# EAGLE board half (EAGLE 8.2.2)
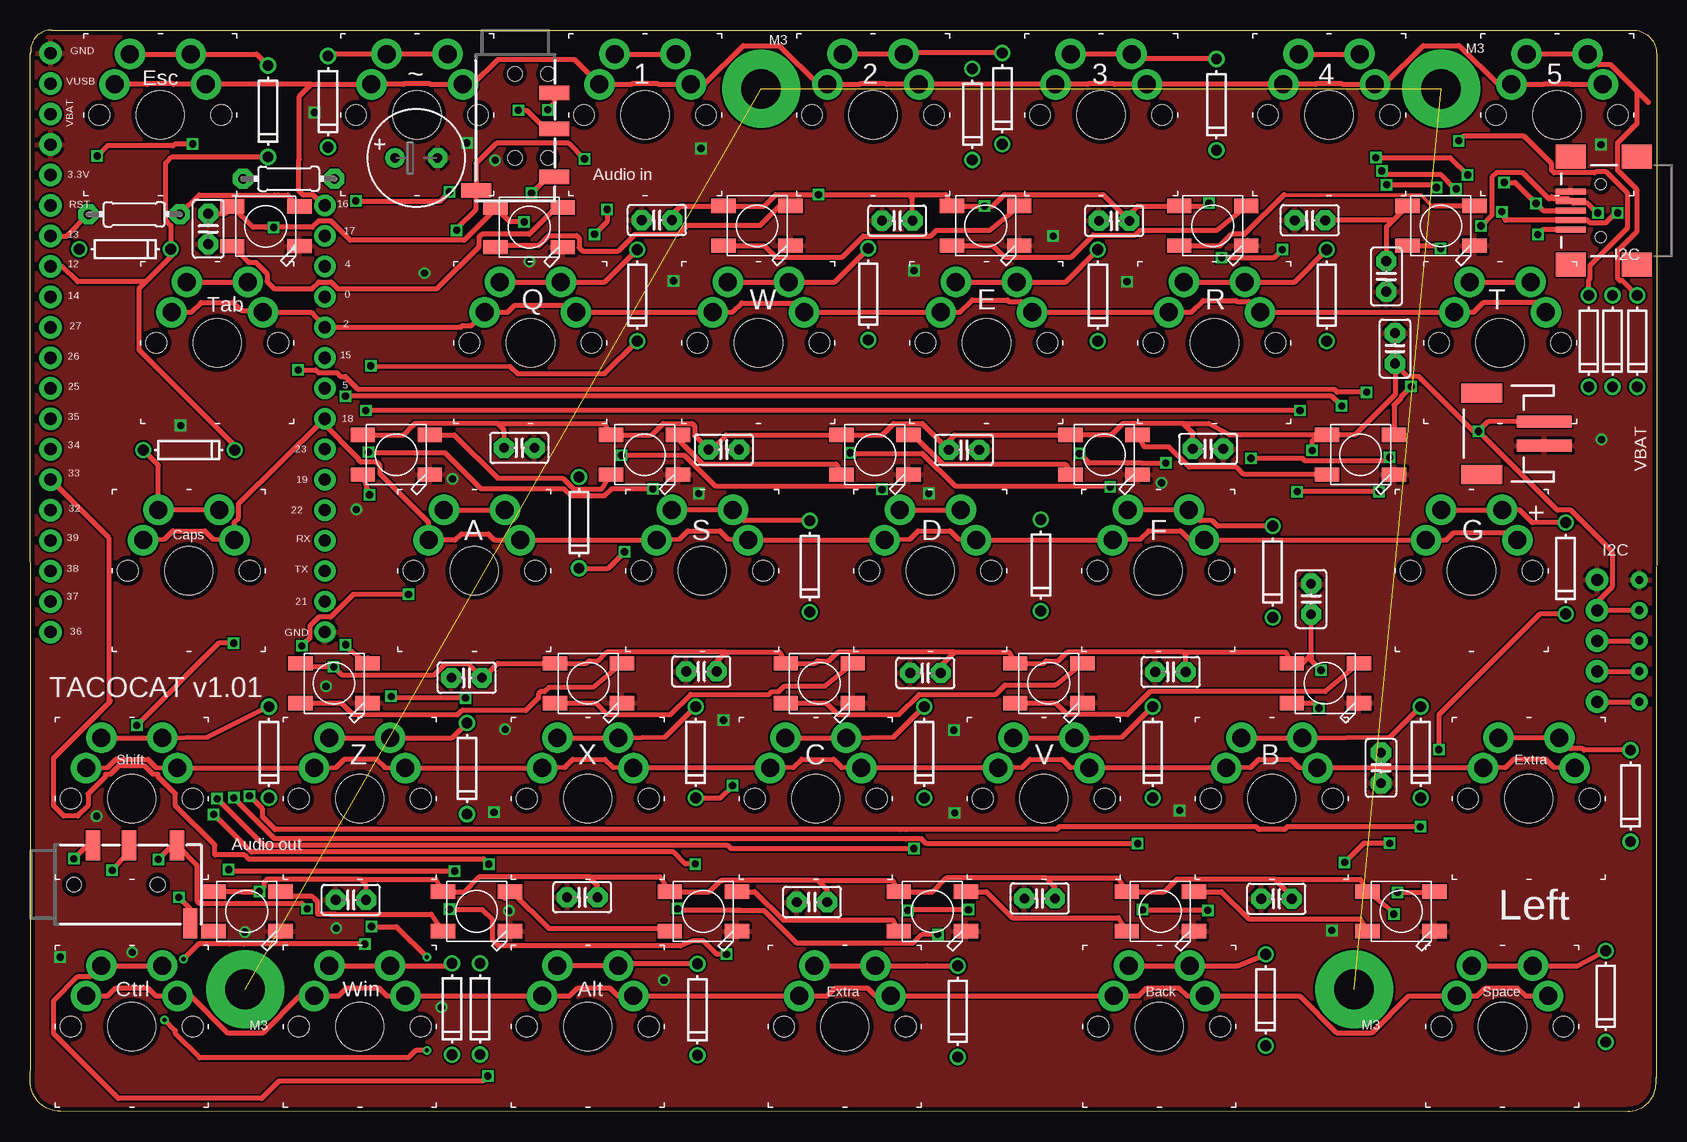
[diagram p3: board, top side]
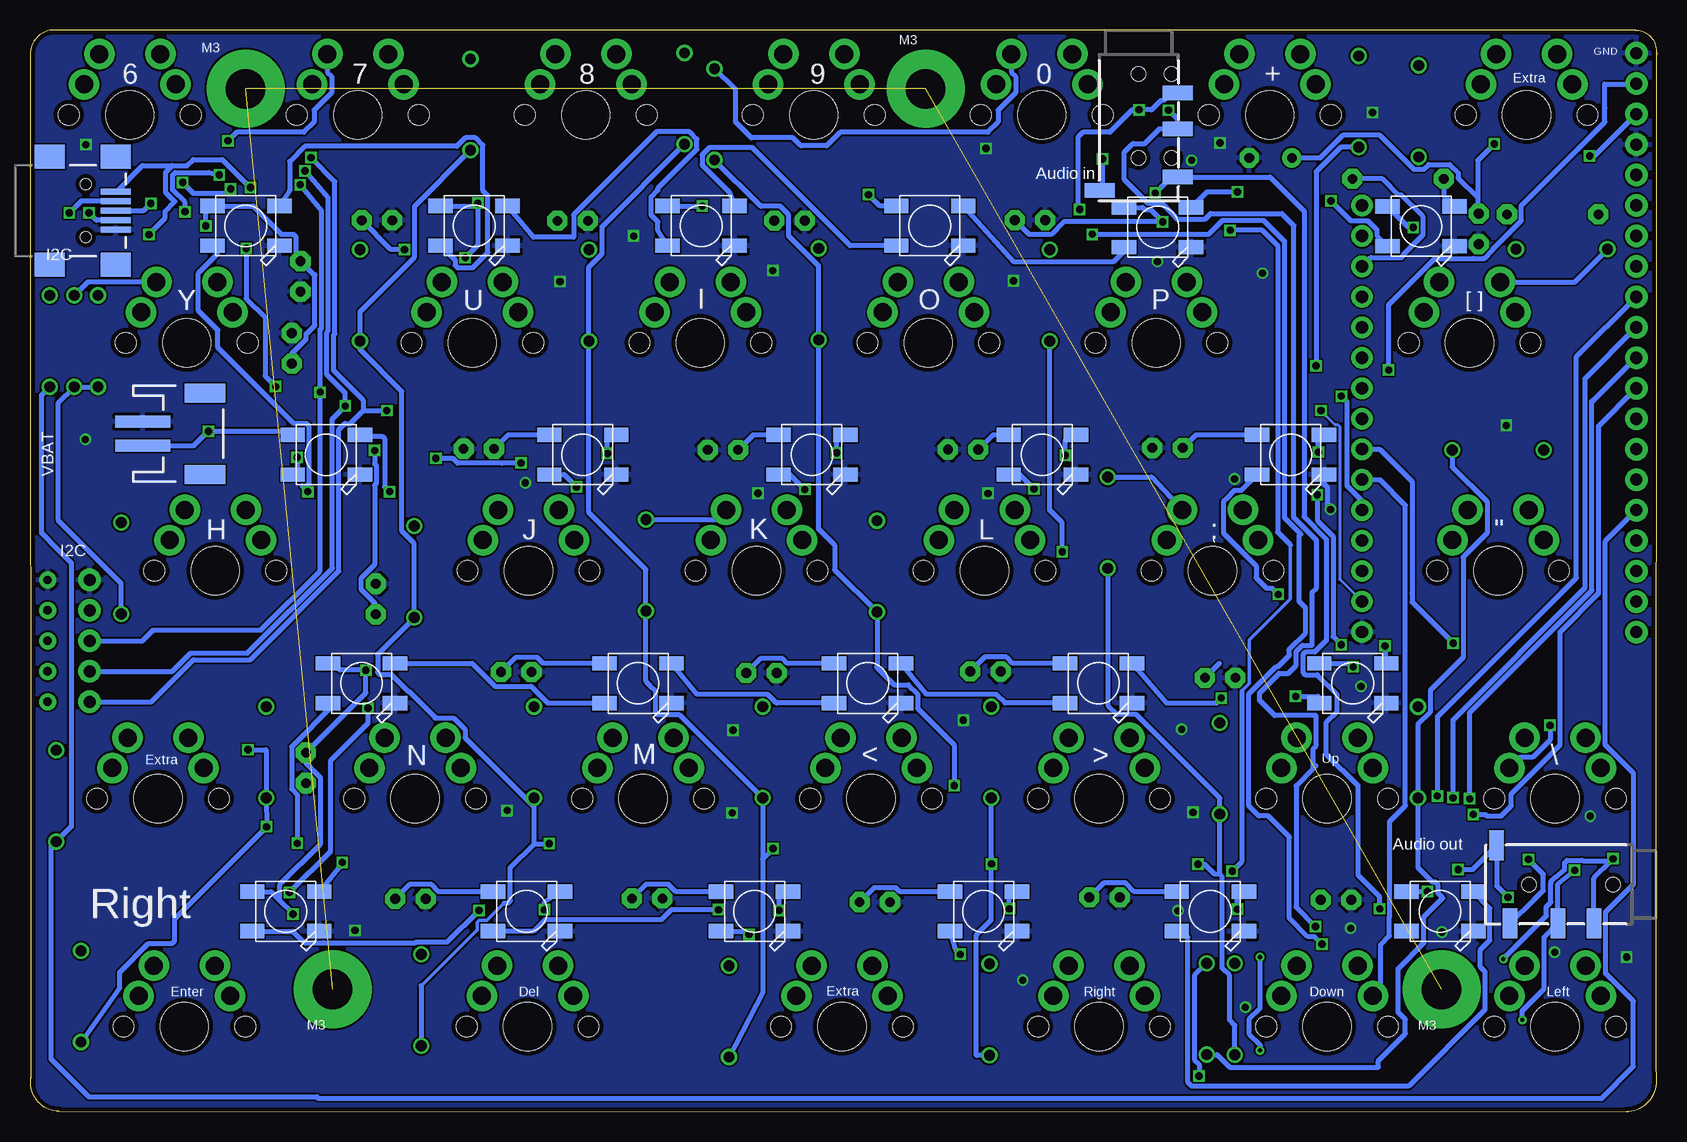
[diagram p4: board, bottom side, seen from below]

Size 135.57 x 90.17 mm. Coordinates in mm from the lower left corner, seen from the top.
Outline: 135.57,88.21 135.52,2.79
Outline: 133.21,0.03 2.46,0
Outline: 0.05,3.34 0,88.22
Outline: 1.75,90.17 1.8,90.17
Outline: 1.8,90.17 133.55,90.17
Outline: 133.55,90.17 133.56,90.17
Outline: 0,88.32 0,88.22
Outline: 0,88.22 0,88.12
Outline: 2.55,0.02 arc-90 0,2.57 0,3.32
Outline: 133.15,0.02 arc90 135.5,2.37 135.5,2.82
Outline: 1.8,90.17 arc90 0.05,88.42 0.05,88.27
Outline: 133.55,90.17 arc-90 135.55,88.17 135.55,88.12
Copper layers (1*16): Top 0.0356mm / dielectric 1.5011mm / Bottom 0.0356mm
Design rules "OshPark *": minimum track width 6mil, minimum drill 13mil, track to track 6mil, track to pad 6mil, pad to pad 6mil, via to via 6mil, smd to smd 6mil, copper to edge 15mil, drill to drill 6mil, minimum pad ring 7mil, minimum via ring 7mil, stop-mask expansion 1mil, vias tented up to drill 0mil, thermal gap 10mil

## Footprints (pad centres in the part's own frame; a part is rotated, then mirrored left to right if it is on the bottom)
C025-025X050 = drill 0.813 pad 1.676 octagon: 1 -1.27,0; 2 1.27,0
E3,5-8 = drill 0.813 pad 1.6: + -1.778,0 | drill 0.813 pad 1.6 octagon: - 1.778,0
DO-1N4148 = drill 0.9: A -3.81,0; C 3.81,0
1X20_NOSILK = drill 1.016 pad 1.88: 1 0,0; 2 2.54,0; 3 5.08,0; 4 7.62,0; 5 10.16,0; 6 12.7,0; 7 15.24,0; 8 17.78,0; 9 20.32,0; 10 22.86,0; 11 25.4,0; 12 27.94,0; 13 30.48,0; 14 33.02,0; 15 35.56,0; 16 38.1,0; 17 40.64,0; 18 43.18,0; 19 45.72,0; 20 48.26,0
1X05_NO_SILK_SMALL = drill 0.7 pad 1.422: 1 0,0; 2 2.54,0; 3 5.08,0; 4 7.62,0; 5 10.16,0
USB-MINIB = smd 2.5 x 0.5: D+ 2.5,0; D- 2.5,0.8; GND 2.5,-1.6; ID 2.5,-0.8; VBUS 2.5,1.6 | smd 2.5 x 2: S1 -3,4.5; S2 2.5,4.5; S3 -3,-4.5; S4 2.5,-4.5 | hole 0.9: 0,2.2; 0,-2.2
JST-2-SMD = smd 1 x 4.6: 1 -1,-3.7; 2 1,-3.7 | smd 1.6 x 3.4: NC1 -3.4,1.5; NC2 3.4,1.5
AUDIO_JACK_3.5MM_TRRS_SMD_RA = smd 1.2 x 2.5: EARTH 11.3,-3.25; RING1 6.2,3.25; RING2 3.2,3.25; TIP 10.2,3.25 | hole 1.2: 1.6,0; 8.6,0
1X05_NO_SILK = drill 1.016 pad 1.88: 1 0,0; 2 2.54,0; 3 5.08,0; 4 7.62,0; 5 10.16,0
1X15-CB = drill 1.016 pad 1.778: 1 -17.78,0; 2 -15.24,0; 3 -12.7,0; 4 -10.16,0; 5 -7.62,0; 6 -5.08,0; 7 -2.54,0; 8 0,0; 9 2.54,0; 10 5.08,0; 11 7.62,0; 12 10.16,0; 13 12.7,0; 14 15.24,0; 15 17.78,0
WS2812B-NARROW-PADS = smd 2.032 x 1.2: 1-VDD 2.794,-1.65; 2-DOUT 2.794,1.65; 3-GND -2.794,1.65; 4-DIN -2.794,-1.65
0204/7 = drill 0.813 pad 1.676 octagon: 1 -3.81,0; 2 3.81,0
CHERRY-MX-SYMM-NOSILK = drill 1.5 pad 2.54: SW1@0 -3.81,2.54; SW1@1 3.81,2.54; SW2@0 2.54,5.08; SW2@1 -2.54,5.08 | hole 4: 0,0 | hole 1.714: 5.08,0; -5.08,0

## Placement (x,y rotation side)
C1  .1 uF  [C025-025X050]  98.17,55.25 0 top
C2  .1 uF  [C025-025X050]  40.77,55.33 0 top
C3  .1 uF  [C025-025X050]  90.35,74.26 180 top
C4  .1 uF  [C025-025X050]  113.75,63.62 90 top
C5  .1 uF  [C025-025X050]  72.27,74.27 180 top
C6  .1 uF  [C025-025X050]  113.03,69.62 270 top
C7  .1 uF  [C025-025X050]  77.83,55.16 0 top
C8  .1 uF  [C025-025X050]  106.66,74.3 180 top
C9  .1 uF  [C025-025X050]  57.81,55.19 0 top
C10  .1 uF  [C025-025X050]  52.24,74.32 180 top
C11  .1 uF  [C025-025X050]  14.85,73.59 270 top
C12  .1 uF  [C025-025X050]  36.39,36.16 180 top
C13  .1 uF  [C025-025X050]  106.76,42.73 90 top
C14  .1 uF  [C025-025X050]  74.62,36.56 180 top
C15  .1 uF  [C025-025X050]  55.95,36.69 180 top
C16  .1 uF  [C025-025X050]  95.05,36.65 180 top
C17  1000uF  [E3,5-8]  32.19,79.51 0 top
C23  .1 uF  [C025-025X050]  26.74,17.64 180 top
C24  .1 uF  [C025-025X050]  65.17,17.46 180 top
C25  .1 uF  [C025-025X050]  103.87,17.73 180 top
C26  .1 uF  [C025-025X050]  112.58,28.65 270 top
C27  .1 uF  [C025-025X050]  46.02,17.86 180 top
C28  .1 uF  [C025-025X050]  84.14,17.76 180 top
D1  [DO-1N4148]  19.84,83.4 270 top
D2  [DO-1N4148]  24.84,84.2 270 top
D3  [DO-1N4148]  78.53,83.14 270 top
D4  [DO-1N4148]  81.03,84.45 270 top
D5  [DO-1N4148]  98.87,83.95 270 top
D6  [DO-1N4148]  129.9,64.23 270 top
D7  [DO-1N4148]  133.93,64.23 270 top
D8  [DO-1N4148]  7.92,71.9 0 top
D9  [DO-1N4148]  50.6,68.05 270 top
D10  [DO-1N4148]  69.85,68.15 270 top
D11  [DO-1N4148]  88.99,68.05 270 top
D12  [DO-1N4148]  108.07,68.05 270 top
D13  [DO-1N4148]  131.88,64.23 270 top
D15  [DO-1N4148]  13.24,55.15 0 top
D16  [DO-1N4148]  45.75,49.1 270 top
D17  [DO-1N4148]  64.98,45.45 270 top
D18  [DO-1N4148]  84.24,45.55 270 top
D19  [DO-1N4148]  103.55,45 270 top
D20  [DO-1N4148]  127.97,45.29 270 top
D22  [DO-1N4148]  19.91,29.95 270 top
D23  [DO-1N4148]  36.42,28.6 270 top
D24  [DO-1N4148]  55.47,29.95 270 top
D25  [DO-1N4148]  74.52,29.95 270 top
D26  [DO-1N4148]  93.57,29.95 270 top
D27  [DO-1N4148]  115.89,29.95 270 top
D28  [DO-1N4148]  133.38,26.32 270 top
D29  [DO-1N4148]  37.5,8.56 270 top
D30  [DO-1N4148]  35.17,8.55 270 top
D31  [DO-1N4148]  55.62,8.5 270 top
D32  [DO-1N4148]  77.32,8.35 270 top
D33  [DO-1N4148]  102.97,9.3 270 top
D34  [DO-1N4148]  131.32,9.6 270 top
J1  [1X20_NOSILK]  1.71,39.98 90 top
J2  [1X05_NO_SILK_SMALL]  134.1,44.32 270 top
J3  USB_MINI-B_SMT  [USB-MINIB]  130.91,75.11 0 bottom
J4  [JST-2-SMD]  122.48,56.51 90 top
J5  USB_MINI-B_SMT  [USB-MINIB]  130.91,75.11 180 top
J7  AUDIO_JACK_TRRSSMD_RA  [AUDIO_JACK_3.5MM_TRRS_SMD_RA]  40.43,88.11 270 top
J8  AUDIO_JACK_TRRSSMD_RA  [AUDIO_JACK_3.5MM_TRRS_SMD_RA]  43.18,88.11 270 bottom
J9  AUDIO_JACK_TRRSSMD_RA  [AUDIO_JACK_3.5MM_TRRS_SMD_RA]  2.05,18.93 0 top
J10  AUDIO_JACK_TRRSSMD_RA  [AUDIO_JACK_3.5MM_TRRS_SMD_RA]  2.05,18.93 180 bottom
J11  [JST-2-SMD]  122.48,56.51 270 bottom
J12  [1X05_NO_SILK]  130.6,44.32 270 top
JP3  [1X15-CB]  24.57,57.76 270 top
LED1  WS2812BLONGPADS  [WS2812B-NARROW-PADS]  19.65,73.8 180 top
LED2  WS2812BLONGPADS  [WS2812B-NARROW-PADS]  114.26,16.68 180 top
LED3  WS2812BLONGPADS  [WS2812B-NARROW-PADS]  94.19,16.68 180 top
LED4  WS2812BLONGPADS  [WS2812B-NARROW-PADS]  75.19,16.68 180 top
LED5  WS2812BLONGPADS  [WS2812B-NARROW-PADS]  56.11,16.68 180 top
LED6  WS2812BLONGPADS  [WS2812B-NARROW-PADS]  37.21,16.68 180 top
LED7  WS2812BLONGPADS  [WS2812B-NARROW-PADS]  18.07,16.68 180 top
LED8  WS2812BLONGPADS  [WS2812B-NARROW-PADS]  25.34,35.71 180 top
LED9  WS2812BLONGPADS  [WS2812B-NARROW-PADS]  46.53,35.71 180 top
LED10  WS2812BLONGPADS  [WS2812B-NARROW-PADS]  65.77,35.71 180 top
LED11  WS2812BLONGPADS  [WS2812B-NARROW-PADS]  84.9,35.71 180 top
LED12  WS2812BLONGPADS  [WS2812B-NARROW-PADS]  107.94,35.71 180 top
LED13  WS2812BLONGPADS  [WS2812B-NARROW-PADS]  110.88,54.76 180 top
LED14  WS2812BLONGPADS  [WS2812B-NARROW-PADS]  89.51,54.76 180 top
LED15  WS2812BLONGPADS  [WS2812B-NARROW-PADS]  70.41,54.76 180 top
LED16  WS2812BLONGPADS  [WS2812B-NARROW-PADS]  51.21,54.76 180 top
LED17  WS2812BLONGPADS  [WS2812B-NARROW-PADS]  30.52,54.76 180 top
LED18  WS2812BLONGPADS  [WS2812B-NARROW-PADS]  41.6,73.72 180 top
LED19  WS2812BLONGPADS  [WS2812B-NARROW-PADS]  60.59,73.84 180 top
LED20  WS2812BLONGPADS  [WS2812B-NARROW-PADS]  79.64,73.84 180 top
LED21  WS2812BLONGPADS  [WS2812B-NARROW-PADS]  98.56,73.84 180 top
LED22  WS2812BLONGPADS  [WS2812B-NARROW-PADS]  117.58,73.84 180 top
LED23  WS2812BLONGPADS  [WS2812B-NARROW-PADS]  19.65,73.8 180 bottom
LED24  WS2812BLONGPADS  [WS2812B-NARROW-PADS]  114.26,16.68 180 bottom
LED25  WS2812BLONGPADS  [WS2812B-NARROW-PADS]  94.19,16.68 180 bottom
LED26  WS2812BLONGPADS  [WS2812B-NARROW-PADS]  75.19,16.68 180 bottom
LED27  WS2812BLONGPADS  [WS2812B-NARROW-PADS]  56.11,16.68 180 bottom
LED28  WS2812BLONGPADS  [WS2812B-NARROW-PADS]  37.21,16.68 180 bottom
LED29  WS2812BLONGPADS  [WS2812B-NARROW-PADS]  18.07,16.68 180 bottom
LED30  WS2812BLONGPADS  [WS2812B-NARROW-PADS]  25.34,35.71 180 bottom
LED31  WS2812BLONGPADS  [WS2812B-NARROW-PADS]  46.53,35.71 180 bottom
LED32  WS2812BLONGPADS  [WS2812B-NARROW-PADS]  65.77,35.71 180 bottom
LED33  WS2812BLONGPADS  [WS2812B-NARROW-PADS]  84.9,35.71 180 bottom
LED34  WS2812BLONGPADS  [WS2812B-NARROW-PADS]  107.94,35.71 180 bottom
LED35  WS2812BLONGPADS  [WS2812B-NARROW-PADS]  110.88,54.76 180 bottom
LED36  WS2812BLONGPADS  [WS2812B-NARROW-PADS]  89.51,54.76 180 bottom
LED37  WS2812BLONGPADS  [WS2812B-NARROW-PADS]  70.41,54.76 180 bottom
LED38  WS2812BLONGPADS  [WS2812B-NARROW-PADS]  51.21,54.76 180 bottom
LED39  WS2812BLONGPADS  [WS2812B-NARROW-PADS]  30.52,54.76 180 bottom
LED40  WS2812BLONGPADS  [WS2812B-NARROW-PADS]  41.6,73.72 180 bottom
LED41  WS2812BLONGPADS  [WS2812B-NARROW-PADS]  60.59,73.84 180 bottom
LED42  WS2812BLONGPADS  [WS2812B-NARROW-PADS]  79.64,73.84 180 bottom
LED43  WS2812BLONGPADS  [WS2812B-NARROW-PADS]  98.56,73.84 180 bottom
LED44  WS2812BLONGPADS  [WS2812B-NARROW-PADS]  117.58,73.84 180 bottom
R1  330  [0204/7]  8.68,74.8 0 top
R2  330  [0204/7]  21.56,77.76 180 top
U$1  CHERRY-MXSYMM-NOSILK  [CHERRY-MX-SYMM-NOSILK]  10.86,83.09 0 top
U$2  CHERRY-MXSYMM-NOSILK  [CHERRY-MX-SYMM-NOSILK]  32.25,83.09 0 top
U$3  CHERRY-MXSYMM-NOSILK  [CHERRY-MX-SYMM-NOSILK]  51.25,83.09 0 top
U$4  CHERRY-MXSYMM-NOSILK  [CHERRY-MX-SYMM-NOSILK]  70.25,83.09 0 top
U$5  CHERRY-MXSYMM-NOSILK  [CHERRY-MX-SYMM-NOSILK]  89.25,83.09 0 top
U$6  CHERRY-MXSYMM-NOSILK  [CHERRY-MX-SYMM-NOSILK]  15.61,64.09 0 top
U$7  CHERRY-MXSYMM-NOSILK  [CHERRY-MX-SYMM-NOSILK]  41.7,64.09 0 top
U$8  CHERRY-MXSYMM-NOSILK  [CHERRY-MX-SYMM-NOSILK]  60.7,64.09 0 top
U$9  CHERRY-MXSYMM-NOSILK  [CHERRY-MX-SYMM-NOSILK]  79.7,64.09 0 top
U$10  CHERRY-MXSYMM-NOSILK  [CHERRY-MX-SYMM-NOSILK]  98.7,64.09 0 top
U$11  CHERRY-MXSYMM-NOSILK  [CHERRY-MX-SYMM-NOSILK]  122.5,64.09 0 top
U$12  CHERRY-MXSYMM-NOSILK  [CHERRY-MX-SYMM-NOSILK]  127.25,83.09 0 top
U$13  CHERRY-MXSYMM-NOSILK  [CHERRY-MX-SYMM-NOSILK]  13.23,45.09 0 top
U$14  CHERRY-MXSYMM-NOSILK  [CHERRY-MX-SYMM-NOSILK]  37.03,45.09 0 top
U$15  CHERRY-MXSYMM-NOSILK  [CHERRY-MX-SYMM-NOSILK]  56.03,45.09 0 top
U$16  CHERRY-MXSYMM-NOSILK  [CHERRY-MX-SYMM-NOSILK]  75.03,45.09 0 top
U$17  CHERRY-MXSYMM-NOSILK  [CHERRY-MX-SYMM-NOSILK]  94.03,45.09 0 top
U$18  CHERRY-MXSYMM-NOSILK  [CHERRY-MX-SYMM-NOSILK]  120.13,45.09 0 top
U$20  CHERRY-MXSYMM-NOSILK  [CHERRY-MX-SYMM-NOSILK]  8.48,26.09 0 top
U$21  CHERRY-MXSYMM-NOSILK  [CHERRY-MX-SYMM-NOSILK]  27.48,26.09 0 top
U$22  CHERRY-MXSYMM-NOSILK  [CHERRY-MX-SYMM-NOSILK]  46.48,26.09 0 top
U$23  CHERRY-MXSYMM-NOSILK  [CHERRY-MX-SYMM-NOSILK]  65.48,26.09 0 top
U$24  CHERRY-MXSYMM-NOSILK  [CHERRY-MX-SYMM-NOSILK]  84.48,26.09 0 top
U$25  CHERRY-MXSYMM-NOSILK  [CHERRY-MX-SYMM-NOSILK]  103.48,26.09 0 top
U$26  CHERRY-MXSYMM-NOSILK  [CHERRY-MX-SYMM-NOSILK]  108.25,83.09 0 top
U$28  CHERRY-MXSYMM-NOSILK  [CHERRY-MX-SYMM-NOSILK]  124.91,26.09 0 top
U$29  CHERRY-MXSYMM-NOSILK  [CHERRY-MX-SYMM-NOSILK]  8.48,7.09 0 top
U$30  CHERRY-MXSYMM-NOSILK  [CHERRY-MX-SYMM-NOSILK]  27.48,7.09 0 top
U$31  CHERRY-MXSYMM-NOSILK  [CHERRY-MX-SYMM-NOSILK]  46.48,7.09 0 top
U$32  CHERRY-MXSYMM-NOSILK  [CHERRY-MX-SYMM-NOSILK]  67.91,7.09 0 top
U$33  CHERRY-MXSYMM-NOSILK  [CHERRY-MX-SYMM-NOSILK]  94.11,7.09 0 top
U$34  CHERRY-MXSYMM-NOSILK  [CHERRY-MX-SYMM-NOSILK]  122.7,7.09 0 top

## Tracks (layer width: path | path; a pad name or v marks a point on that pad's centre or on a via)
4
  Bottom 0.406: 19.47,73.68 19.47,73.09 21.07,71.49 21.07,71.4 21.28,71.19 23.84,71.19 JP3.3 | 19.47,73.68 19.47,74.34 | R2.1 22.86,77.76 21.5,76.41 21.28,76.41 19.47,74.59 19.47,73.68
13
  Top 0.406: J1.14 3.07,73 R1.1
C1
  Top 0.406: J1.13 2.69,70.46 3.97,69.18 9.63,69.18 | D1.C 11.82,79.59 11.3,79.07 11.3,74.31 11.73,73.87 D8.C 11.73,71.27 9.63,69.18 | 9.63,69.18 9.08,68.63 9.08,63.49 17.05,55.53 D15.C
  Bottom 0.406: D15.C 17.05,53.75 14.14,50.84 14.14,48.23 16.14,46.23 16.14,37.85 18.88,35.11 18.88,33.33 19.91,32.3 D22.C 19.91,20.34 18.73,19.16 18.48,19.16 18.28,18.95 18.28,18.25 17.83,17.8 19.41,16.22 19.41,14.06 21.55,11.92 21.55,8.28 20.96,7.69 20.96,6.49 23.21,4.24 23.21,3.71 35.6,3.71 36.64,4.75 D29.C
C2  (via drill 0.6)
  Top 0.406: D16.C 48.17,45.29 v49.55,46.67 | v28.4,62.17 40.02,62.12 40.63,61.51 47.87,61.51 D9.C | v38.23,20.63 37.79,21.07 18.21,21.07 17.89,21.38 15.4,21.38 15.4,22.21 12.12,25.49 12.12,26.5 10.66,27.96 10.66,28.12 10.49,28.12 10.26,28.12 10.25,28.12 9.57,28.8 7.39,28.8 6.71,28.12 6.7,28.12 6.47,28.12 6.3,28.12 6.3,27.96 4.84,26.5 4.84,25.49 4,24.65 2.8,24.65 1.96,25.49 1.96,29.49 6.59,34.12 | 6.59,34.12 6.71,34.24 | 6.59,34.12 6.59,47.8 J1.6
  Bottom 0.406: D9.C 50.6,50.14 49.55,49.09 v49.55,46.67 | 36.42,19.79 D23.C 36.42,26.14 43.38,33.1 44.98,33.1 45.75,33.88 D16.C | 36.42,19.79 36.85,19.79 37.68,20.63 v38.23,20.63 | 36.42,19.79 36.22,19.59 36.22,11.96 35.61,11.34 35.61,7.64 35.17,7.2 D30.C | v28.4,62.17 28.4,78.35 26.36,80.39 D2.C
C3  (via drill 0.6)
  Top 0.406: D24.C 57.52,26.14 v58.55,27.17 | v55.44,20.64 54.62,20.64 53.63,21.63 18.44,21.63 v15.3,24.77
  Bottom 0.406: 55.47,21.37 D24.C | 55.47,21.37 55.47,15.98 56.7,14.75 56.7,4.69 D31.C | 55.47,21.37 v55.44,20.64 | v58.55,27.17 58.55,30.57 61.6,33.62 61.6,34.81 62.37,35.58 63.55,35.58 64.98,37 64.98,37.1 | v15.3,24.77 14.28,24.77 14.16,24.65 12.96,24.65 12.12,25.49 12.12,26.5 8.07,30.55 8.07,40 4.85,43.22 4.85,57.16 J1.9 | D3.C 74.66,75.46 73.05,75.46 72.35,74.76 72.35,73 69.85,70.5 D10.C 69.85,48.56 68.51,47.22 68.51,45.17 D17.C 64.98,37.1 | 64.98,37.1 65.03,37.05
C4  (via drill 0.6)
  Top 0.406: v15.6,26.08 19.49,22.19 58.15,22.19 58.42,21.91 v73.65,21.91
  Bottom 0.406: 74.52,21.04 D25.C 81.48,33.1 83.27,33.1 83.48,33.31 83.48,35.1 83.91,35.54 | 74.52,21.04 74.52,9.89 D32.C | 74.52,21.04 v73.65,21.91 | v15.6,26.08 15.6,33.26 5.41,43.45 5.41,59.27 5.28,59.27 J1.10 | D4.C 87.89,73.78 87.89,71.51 88.99,70.4 D11.C 88.99,49.94 84.24,45.19 D18.C 84.24,35.86 83.91,35.54 | 83.91,35.54 83.4,35.02
C5  (via drill 0.6)
  Top 0.406: 92.15,22.33 v92.3,22.33 74.69,22.33 74.27,22.75 73.02,22.75 | 73.02,22.75 72.99,22.72 | 73.02,22.75 20.39,22.75 v16.98,26.15
  Bottom 0.305: 96.09,17.37 97.53,15.93 98.13,15.93 98.3,15.76 98.3,15.16 102.97,10.49
  Bottom 0.406: 93.57,22.33 93.57,25.42 | 93.57,25.42 D26.C | 93.57,22.33 v92.3,22.33 | v16.98,26.15 16.98,32.67 5.97,43.68 5.97,61.12 J1.11 | D5.C 103.52,75.49 103.52,71.23 108.07,66.69 D12.C 108.07,63.52 104.58,60.03 104.58,48.38 103.55,47.35 D19.C 103.55,41.15 106.6,38.11 106.6,36.61 106.39,36.4 105.42,36.4 104.04,35.02 103.98,35.02 101.76,32.8 | 93.57,25.42 99.31,31.16 99.31,31.84 100.27,32.8 101.65,32.8 101.76,32.8 | 101.82,32.8 101.76,32.8 | 96.09,17.37 95.74,17.37 95.53,17.58 95.53,20.37 93.57,22.33 | 102.97,10.49 D33.C
C6  (via drill 0.6)
  Top 0.406: v115.86,23.74 104.78,23.74 104.55,23.51 102.41,23.51 102.17,23.74 85.78,23.74 85.55,23.51 72.99,23.51 | 72.99,23.51 | 72.99,23.51 72.53,23.51 | 72.53,23.51 | 72.53,23.51 20.42,23.51 19.38,24.55 19.38,25.21 18.88,25.71 v18.29,26.3 | v117.4,30.17 117.4,33.07 125.81,41.48 D20.C
  Bottom 0.406: D34.C 128.11,10.3 128.11,11.59 126.87,12.83 126.87,12.84 125.71,14 123.73,14 123.52,14.21 123.52,16.08 v115.86,23.74 D27.C 115.89,30.17 v117.4,30.17 | v18.29,26.3 18.29,32.91 6.71,44.49 6.71,62.92 J1.12 | D20.C 127.97,44.04 133.2,49.27 133.2,59.1 D13.C D6.C
C7
  Bottom 0.406: J1.5 4.29,47.56 4.29,30.55 1.96,28.22 1.96,18.95 4.29,16.61 4.29,11.55 1.96,9.22 1.96,3.75 4.61,1.1 111.53,1.1 111.67,1.24 130.67,1.24 133.8,4.37 133.8,22.09 D28.C 132.13,23.76 132.13,45.74 133.93,47.54 133.93,47.55 134.6,48.22 134.6,59.75 D7.C
GND  (via drill 0.6)
  Bottom 0.406: LED39.3-GND 27.73,52.31 27.46,52.05 27.46,50.48 v27.19,50.2
  other vias: 17.9,14.97 2.51,12.88 55.91,80.3 32.87,69.9 39.6,31.87 38.66,24.95 77.06,24.9 95.81,25.1 76.99,31.8 57.79,32.63 73.67,70.11 91.41,69.19 53.62,69.26 12.55,57.2 55.73,51.53 74.9,51.54 35.2,52.74 85.26,72.99 108.49,15.1 36.4,80.76 23.7,83.3 34.29,8.7 94.29,52.42 5.55,24.63 130.92,80.61 8.52,13.28 25.52,15.28 24.66,35.45 52.84,10.95 39.9,16.74 38.76,79.31 41.61,70.87 130.96,56.03
  pour Bottom: -4.25,-0.63 141.83,-0.53 141.43,94.48 -5.89,94.48
  pour Top: -2.18,-0.85 139.39,-1.14 139.79,91.49 -2.08,90.67
N$1
  Top 0.406: U$1.SW2@1 U$1.SW2@0 18.88,88.17 D1.A
N$2
  Top 0.406: U$28.SW2@1 U$28.SW2@0 128.36,30.26 129.39,30.26 129.51,30.13 D28.A
N$3
  Top 0.406: U$6.SW2@1 U$6.SW2@0
  Bottom 0.406: U$6.SW2@1 6.84,69.17 D8.A
N$4
  Top 0.406: U$13.SW2@0 U$13.SW2@1 10.69,53.89 D15.A
N$5
  Top 0.406: U$20.SW2@1 U$20.SW2@0 14.83,31.22 D22.A
N$6  (via drill 0.6)
  Top 0.406: U$29.SW2@0 U$29.SW2@1 5.03,11.26 4,11.26 1.96,9.22 1.96,6.49 7.35,1.1 19.31,1.1 20.77,2.56 37.75,2.56 v38.15,2.96
  Bottom 0.406: v38.15,2.96 38.15,3.94 38.53,4.32 38.53,11.34 D29.A
N$7
  Top 0.406: U$12.SW2@1 U$12.SW2@0 130.71,87.26 131.74,87.26 133.64,85.35 | 133.64,85.35 134.88,84.12 | 133.64,85.35 133.93,85.06 133.93,82.38 132.3,80.76 132.3,78.46 133.93,76.84 133.93,73.38 132.3,71.76 132.3,69.46 132.51,69.25 132.72,69.25 D7.A
N$8
  Top 0.406: U$2.SW2@0 U$2.SW2@1 | 29.61,88.06 U$2.SW2@1 | U$2.SW2@1 25,88.17 D2.A
N$9
  Top 0.406: U$7.SW2@1 U$7.SW2@0 47.91,69.17 D9.A
N$10
  Top 0.406: U$14.SW2@1 U$14.SW2@0
  Bottom 0.406: D16.A 42.11,52.91 U$14.SW2@0
N$11
  Top 0.406: U$30.SW2@1 U$30.SW2@0 34.98,12.17 D30.A
N$12
  Top 0.406: U$31.SW2@1 U$31.SW2@0 49.02,12.31 D31.A
N$13
  Top 0.406: U$22.SW2@1 U$22.SW2@0 52.93,31.22 D24.A
N$14
  Top 0.406: U$15.SW2@1 U$15.SW2@0 59.48,49.26 D17.A
N$15
  Top 0.406: D10.A 67.06,69.17 U$8.SW2@0 U$8.SW2@1
N$16
  Top 0.406: U$3.SW2@1 U$3.SW2@0
  Bottom 0.406: U$3.SW2@0 53.79,86.66 53.44,86.3 53.44,84.96 54.89,83.5 54.89,82.49 55.74,81.65 68.04,81.65 69.19,80.51 71.33,80.51 72,81.18 75.46,81.18 76.78,82.49 76.78,85.2 D3.A
N$17
  Top 0.406: U$4.SW2@1 U$4.SW2@0 72.88,88.26 D4.A
N$18
  Top 0.406: U$9.SW2@1 U$9.SW2@0 86.3,69.17 D11.A
N$19
  Top 0.406: U$16.SW2@1 U$16.SW2@0
  Bottom 0.406: D18.A 78.38,49.36 U$16.SW2@0
N$20
  Top 0.406: U$23.SW2@1 U$23.SW2@0 71.98,31.22 D25.A
N$21
  Top 0.406: U$32.SW2@1 U$32.SW2@0 74.78,12.17 D32.A
N$22
  Top 0.406: U$33.SW2@1 U$33.SW2@0 100.63,12.17 D33.A
N$23
  Top 0.406: U$24.SW2@1 U$24.SW2@0 91.03,31.22 D26.A
N$24
  Top 0.406: U$17.SW2@1 U$17.SW2@0 97.48,49.26 98.51,49.26 98.96,48.81 D19.A
N$25
  Top 0.406: U$10.SW2@1 U$10.SW2@0 105.38,69.17 D12.A
N$26
  Top 0.406: U$5.SW2@1 U$5.SW2@0 92.2,87.76 D5.A
N$27  (via drill 0.6)
  Top 0.406: U$26.SW2@1 U$26.SW2@0 110.98,88.17 | D6.A 129.9,69.35 130.02,69.46 130.02,70.55 133.13,73.67 133.13,76.55 131.34,78.34 130.48,78.34 130.39,78.25 127.01,78.25 126.8,78.46 126.8,79.01 124.51,81.3 119.43,81.3 v119.06,80.93
  Bottom 0.406: v119.06,80.93 118.34,81.65 112.74,81.65 111.89,82.49 111.89,83.5 110.44,84.96 110.44,86.3 110.8,86.66 U$26.SW2@0
N$28
  Top 0.406: U$11.SW2@1 U$11.SW2@0
  Bottom 0.406: U$11.SW2@0 130.75,69.17 D13.A
N$29
  Top 0.406: U$18.SW2@1 U$18.SW2@0 124.13,50.17 125.2,49.1 D20.A
N$30
  Top 0.406: U$25.SW2@1 U$25.SW2@0 113.35,31.22 D27.A
N$31
  Top 0.406: U$34.SW2@1 U$34.SW2@0 128.98,12.17 D34.A
N$32  (via drill 3.3 pad 6.5)  (3 unrouted)
  other vias: 110.35,10.19 117.6,85.27 60.93,85.27 17.93,10.19
N$33
  Top 0.406: LED1.2-DOUT 18.21,70.8 18.82,70.8 19.77,69.84 19.77,69.2 20.37,68.6 23.49,68.6 24.05,69.16 25.09,69.16 25.65,68.6 33.91,68.6 37.43,72.13 37.43,72.94 37.64,73.15 41.61,73.15 43.83,75.37 LED18.4-DIN
N$34
  Top 0.406: LED19.4-DIN 62.43,75.49 60.81,73.88 54.75,73.88 54,73.13 50.41,73.13 49.02,71.73 46.06,71.73 45.77,72.03 45.77,72.82 45.56,73.03 43.23,73.03 42.39,72.19 38.93,72.19 LED18.2-DOUT
N$35
  Top 0.406: LED19.2-DOUT 61.19,72.19 62.14,71.23 67.67,71.23 69.42,72.99 75.07,72.99 75.55,73.47 79.97,73.47 LED20.4-DIN
N$36  (via drill 0.35, 0.6)
  Top 0.406: J9.RING1 8.74,22.18 v6.85,20.12 | J7.RING1 42.98,81.91 41.4,83.48 v40.69,83.48 | v28.45,15.41 30.53,15.41 v33.07,12.88 | v11.21,7.64 12.12,6.73 12.12,6.49 14.15,4.47 31.52,4.47 32.15,5.1 v33.07,5.1
  Bottom 0.406: 28.39,28.83 28.63,28.6 | 28.63,28.6 30.06,27.16 30.06,17.03 v28.45,15.41 | v6.85,20.12 8.25,18.97 J10.RING1 9.39,14.54 9.39,10.23 11.21,8.41 v11.21,7.64 | 40.62,81.91 J8.RING1 | J8.RING1 39.93,82.72 v40.69,83.48 | J8.RING1 41.06,81.91 | J8.RING1 41.47,81.91 42.69,80.69 43.67,80.69 44.36,80 44.36,77.68 42.42,75.74 41.25,75.74 40.18,74.66 40.18,74.62 39.97,74.41 37.64,74.41 37.18,74.87 31.25,74.87 30.25,73.86 30.25,49.52 28.35,47.62 28.35,43.67 28.72,43.3 28.72,38.87 29.53,38.87 30.06,38.34 30.06,37.21 30.73,36.54 31.47,36.54 33.1,34.91 33.1,34.27 31.84,33.01 28.39,33.01 28.39,30.5 28.63,30.26 28.63,28.6 | v33.07,12.88 33.07,8.62 34,7.69 34,6.49 33.07,5.56 v33.07,5.1
N$37  (via drill 0.6)
  Top 0.406: 115.1,60.23 v115.1,60.45 114.31,59.66 114.31,59.54 113.67,58.9 LED13.4-DIN | LED22.2-DOUT 117.33,72.19 v117.55,71.97
  Bottom 0.406: v117.55,71.97 117.55,67.78 115.98,66.22 115.98,61.33 v115.1,60.45
N$38
  Top 0.406: U$21.SW2@1 U$21.SW2@0 35.18,31.17 D23.A
N$39
  Top 0.406: LED21.4-DIN 98.89,73.47 92.52,73.47 92.11,73.07 88.59,73.07 86.75,71.23 81.19,71.23 80.24,72.19 LED20.2-DOUT
N$40
  Top 0.406: LED13.2-DOUT 101.16,53.11 100.55,53.72 96.6,53.72 94.9,55.42 92.85,55.42 LED14.4-DIN
N$41
  Top 0.406: LED15.4-DIN 73.62,56.41 76.07,53.97 86.3,53.97 LED14.2-DOUT
N$42
  Top 0.305: 116.98,75.49 116.83,75.49 115.93,76.39 104.56,76.39 104.51,76.45
  Top 0.406: LED21.2-DOUT 99.16,72.19 100.11,73.15 101.21,73.15 104.51,76.45 | LED22.4-DIN 116.98,75.49
N$43  (via drill 0.6)
  Top 0.406: 12.39,22.18 J9.TIP | J7.TIP 43.14,77.91 v41.8,76.57 | J9.TIP 11.86,22.18 v10.7,21.02 | v23.1,16.9 22.64,17.36 14.18,17.36 14.11,17.37 13.9,17.58 13.9,20.53 J9.TIP
  Bottom 0.406: v41.8,76.57 40.46,77.91 J8.TIP 32.22,77.91 29.39,75.08 29.39,49.6 27.53,47.73 27.53,39.27 28.49,38.32 29.3,38.32 29.51,38.11 29.51,36.61 29.3,36.4 28.28,36.4 26.68,34.81 26.68,33.31 27.53,32.47 27.53,29.79 24.9,27.16 24.9,19.7 23.1,17.9 v23.1,16.9 | J10.TIP 10.18,17.75 10.16,17.75 9.47,18.44 9.47,19.79 v10.7,21.02
N$44  (via drill 0.35, 0.6)
  Top 0.406: 43.09,84.91 J7.RING2 43.68,84.05 v43.15,83.52 | J9.RING2 4.76,22.18 v3.65,21.07 | v48.1,75.21 48.1,74.2 v47.05,73.15 | v27.9,13.97 17.83,13.97 | 17.83,13.97 16.61,13.97 | 17.83,13.97 14.04,13.97 v12.79,12.72
  Bottom 0.406: 30.48,48.96 | v27.9,13.97 28.51,14.58 29.07,14.58 30.62,16.13 30.62,22.88 32.39,24.65 33.16,24.65 34,25.49 34,34.8 33.66,35.14 | 30.48,48.96 29.66,48.14 29.8,48 29.8,43.01 29.81,43 29.81,42.53 29.28,42 29.28,39.92 30.62,38.57 30.62,38.03 31.55,37.1 31.7,37.1 33.66,35.14 | 30.48,48.96 31.04,49.52 31.04,72.57 32.78,74.31 36.18,74.31 37.35,73.15 v47.05,73.15 | J10.RING2 5.25,19.47 3.81,20.91 | J8.RING2 40.51,84.91 41.1,84.31 41.31,84.31 42.11,83.52 v43.15,83.52 43.71,83.52 45.58,81.65 47.82,81.65 48.24,81.23 48.24,75.35 v48.1,75.21 | 3.81,20.91 v3.65,21.07 | 3.81,20.91 6.19,20.91 6.22,20.95 7.47,20.95 7.68,20.75 7.68,20.18 8.48,19.53 8.63,19.38 8.78,19.25 8.79,19.22 8.81,19.2 8.83,19 8.83,17.45 9.21,17.08 9.21,16.31 v12.79,12.72 | 33.66,35.14
N$45  (via drill 0.6)
  Top 0.406: v46.2,79.42 44.85,80.77 38.9,80.77 37.18,79.05 J7.EARTH 37.18,75.25 35.56,73.63 v35.56,73.48 | J9.EARTH 13.35,16.91 v12.4,17.86 | v16.56,20.17 16.68,20.04 v35.39,20.04
  Bottom 0.305: 34.56,35.03 34.56,35.1 33.98,35.69 33.98,39.31 30.56,42.72 30.56,47.17 30.51,47.22
  Bottom 0.406: 13.15,21.98 J10.EARTH | v46.2,79.42 46.2,77.04 J8.EARTH | 30.51,47.22 31.6,48.31 31.6,72.21 32.87,73.48 v35.56,73.48 | v35.39,20.04 34.56,20.87 34.56,35.03 | J10.EARTH 15.36,20.17 v16.56,20.17 | J10.EARTH 13.35,18.81 v12.4,17.86
N$46  (via drill 0.6)
  Top 0.406: v31.55,43.12 26.95,43.12 25.05,41.23 24.05,41.23 23.32,40.5 23.32,39.5 v22.65,38.82
  Bottom 0.406: 35.16,51.8 35.87,51.08 | 35.87,51.08 36.12,50.84 36.12,48.23 33.39,45.5 33.39,44.49 32.55,43.65 32.08,43.65 v31.55,43.12 | v22.65,38.82 22.65,37.7 LED30.4-DIN | 35.87,51.08 35.16,51.8 | 35.16,51.8 34.63,51.8 LED39.2-DOUT
N$47  (via drill 0.6)
  Top 0.406: v113.3,22.37 111.15,22.37 v109.55,20.77
  Bottom 0.406: LED34.2-DOUT 110.29,33.9 113.77,30.41 113.77,26.89 113.3,26.41 v113.3,22.37 | v109.55,20.77 109.55,20.69 LED24.4-DIN
N$48
  Top 0.406: 20.37,76.41 14.1,76.41 R1.2 | 20.37,76.41 20.68,76.41 | 20.37,76.41 21.49,76.41 LED1.4-DIN
N$49
  Top 0.406: LED16.4-DIN 53.63,56.41 56.05,54 67.17,54 LED15.2-DOUT
N$50
  Top 0.406: LED8.2-DOUT 25.94,34.06 26.89,33.1 35.66,33.1 35.99,33.44 41.32,33.44 42.36,34.48 42.36,34.81 42.57,35.02 42.9,35.02 43.25,35.37 46.89,35.37 LED9.4-DIN
N$51
  Top 0.406: LED9.2-DOUT 47.13,34.06 48.08,33.1 53.36,33.1 55.04,34.79 61.59,34.79 61.81,35.02 62.4,35.02 62.85,35.47 66.23,35.47 LED10.4-DIN
N$52
  Top 0.406: LED10.2-DOUT 66.37,34.06 67.32,33.1 72.41,33.1 74.09,34.79 80.47,34.79 81.25,35.57 85.46,35.57 LED11.4-DIN
N$53
  Top 0.406: LED3.4-DIN 99.29,18.33 101.55,16.07 110.87,16.07 LED2.2-DOUT
N$54  (via drill 0.6)
  Top 0.406: 28.17,37.84 LED8.4-DIN 26.3,38.75 v26.3,38.92 | LED17.2-DOUT 28.17,51.55 v28.3,51.42
  Bottom 0.406: 26.5,39.12 v26.3,38.92 26.97,39.59 26.97,47.96 28.3,49.29 v28.3,51.42
N$55
  Top 0.406: LED4.4-DIN 79.69,18.33 81.85,16.17 90.7,16.17 LED3.2-DOUT
N$56
  Top 0.406: LED5.4-DIN 60.39,18.33 62.75,15.97 71.9,15.97 LED4.2-DOUT
N$57
  Top 0.406: 39.56,17.76 LED6.4-DIN 40.16,18.33 43.23,15.26 53.09,15.26 LED5.2-DOUT 53.72,15.07
N$58  (via drill 0.6)
  Top 0.406: LED12.2-DOUT 106.98,34.06 v107.41,33.63 | 116.19,18.33 LED2.4-DIN 116.55,18.27 v113.95,18.27
  Bottom 0.406: v107.41,33.63 107.41,32.38 110.52,29.27 110.52,21.7 v113.95,18.27
N$59
  Top 0.406: LED6.2-DOUT 33.44,16.45 25.45,16.45 | 24.98,16.45 25.45,16.45 | 25.45,16.45 23.97,16.45 23.97,17.49 23.73,17.73 23.48,17.93 23.46,17.95 20.8,17.95 LED7.4-DIN
N$60
  Top 0.406: LED11.2-DOUT 85.5,34.06 86.45,33.1 91.46,33.1 93.37,35.02 107.95,35.02 LED12.4-DIN
N$61
  Top 0.406: LED17.4-DIN 35.36,56.41 38.96,52.81 44.39,52.81 45.32,51.88 47.63,51.88 LED16.2-DOUT
N$62
  Bottom 0.406: 17.9,77.76 R2.2 17.75,76.34 LED23.4-DIN
N$63  (via drill 0.6)
  Top 0.406: v98.15,16.77 92.75,16.77 v92.7,16.82
  Bottom 0.406: 111.81,14.07 112.71,14.07 113.66,15.03 LED24.2-DOUT | 111.81,14.07 111.11,14.07 | v92.7,16.82 92.7,17.47 LED25.4-DIN | 111.81,14.07 103.46,14.07 103.4,14.14 100.78,14.14 v98.15,16.77
N$64  (via drill 0.6)
  Top 0.406: v78.2,16.82 73.2,16.82 v73.15,16.77
  Bottom 0.406: v73.15,16.77 73.15,18.02 LED26.4-DIN | LED25.2-DOUT 93.59,15.03 92.64,15.99 82.95,15.99 82.12,16.82 v78.2,16.82
N$65  (via drill 0.6)
  Top 0.406: v75.65,14.77 74.33,14.77 73.64,14.07 63.85,14.07 61.16,16.77 58.47,16.77 | 59.25,16.77 58.47,16.77 | 58.47,16.77 54.08,16.77 v53.95,16.9
  Bottom 0.406: LED26.2-DOUT 75.91,15.03 v75.65,14.77 | v53.95,16.9 53.95,18.14 LED27.4-DIN
N$66  (via drill 0.6)
  Top 0.406: v58.05,13.12 57.22,13.12 56.1,14.24 55.24,14.24 54.2,13.8 39.04,13.8 38.55,14.28 38.55,15.97 37.7,16.82 35,16.82 v34.95,16.87
  Bottom 0.406: LED27.2-DOUT 58.46,13.53 v58.05,13.12 | v34.95,16.87 34.95,18.24 LED28.4-DIN
N$67
  Bottom 0.406: LED28.2-DOUT 39.09,14.56 39.09,2.44 38.77,2.13 20.69,2.13 14.32,8.5 14.32,11.68 14.71,12.07 14.71,13.47 13.9,14.28 13.9,16.96 LED29.4-DIN
N$68  (via drill 0.6)
  Top 0.406: v36.3,34.47 30.25,34.47 v30.1,34.62
  Bottom 0.406: LED31.4-DIN 40.88,34.06 36.71,34.06 v36.3,34.47 | v30.1,34.62 28.25,34.62 LED30.2-DOUT
N$69
  Bottom 0.406: LED31.2-DOUT 54.31,34.06 55.04,34.79 60.85,34.79 LED32.4-DIN
N$70
  Bottom 0.406: LED32.2-DOUT 73.36,34.06 74.09,34.79 79.98,34.79 LED33.4-DIN
N$71
  Bottom 0.406: LED33.2-DOUT 92.41,34.06 93.81,35.46 96.81,35.46 98.72,37.36 LED34.4-DIN
N$72  (via drill 0.6)
  Top 0.406: v112.42,51.68 v105.6,51.68
  Bottom 0.406: v112.42,51.68 112.89,52.15 112.51,52.15 112.3,52.36 112.3,57.16 112.51,57.37 113.59,57.37 114.93,58.71 | LED44.2-DOUT 119.93,71.5 121.59,69.84 121.59,66.83 119.92,65.16 119.92,63.7 114.93,58.71 | v105.6,51.68 106.02,52.1 106.02,56.1 106.22,56.3 108.42,56.3 LED35.4-DIN | 114.93,58.71 114.24,58.01
N$73  (via drill 0.6)
  Top 0.406: v87.45,54.87 88.25,54.07 91.49,54.07 92.66,54.07 v94.65,54.07 | 101.82,54.54 v101.75,54.47 106.04,54.47 106.22,54.29 113.05,54.29 v113.31,54.54
  Bottom 0.406: v87.45,54.87 87.45,56.12 LED36.4-DIN | v101.75,54.47 100.35,54.47 99.93,54.06 96.24,54.06 96.22,54.07 v94.65,54.07 | v113.31,54.54 113.31,53.19 LED35.2-DOUT
N$74  (via drill 0.6)
  Top 0.406: v68.35,54.92 68.4,54.87 74.37,54.87 77.09,52.15 89.94,52.15 v90.02,52.07
  Bottom 0.406: LED36.2-DOUT 91.06,53.11 v90.02,52.07 | v68.35,54.92 68.35,56.12 LED37.4-DIN
N$75  (via drill 0.6)
  Top 0.406: v49.3,54.72 54.53,54.72 57.1,52.15 70.72,52.15 v71,51.87
  Bottom 0.406: LED37.2-DOUT 72.24,53.11 v71,51.87 | v49.3,54.72 49.3,55.97 LED38.4-DIN
N$76  (via drill 0.6)
  Top 0.406: v51.9,51.92 48.46,51.92 47.86,51.32 45.09,51.32 44.49,51.92 37.6,51.92 34.61,54.91 | 34.61,54.91 34.6,54.92 | 34.61,54.91 28.28,54.91 v28.2,54.98
  Bottom 0.406: LED38.2-DOUT 53.09,53.11 v51.9,51.92 | v28.2,54.98 28.2,56.38 LED39.4-DIN
N$77  (via drill 0.6)
  Top 0.406: v27.15,75.92 34.2,75.92 v34.95,76.67
  Bottom 0.406: v27.15,75.92 25.48,74.24 24.05,74.24 23.32,73.52 23.32,73.03 LED23.2-DOUT | LED40.4-DIN 37.51,76.67 v34.95,76.67
N$78
  Bottom 0.406: LED41.4-DIN 53.58,70.83 45.31,70.83 44.39,71.75 LED40.2-DOUT
N$79
  Bottom 0.406: LED42.4-DIN 77.29,76.63 79.56,78.9 79.56,79.76 78.96,80.36 75.4,80.36 67.23,72.19 LED41.2-DOUT
N$80
  Bottom 0.406: LED42.2-DOUT 83.24,73.44 83.24,74.18 83.81,74.74 83.81,76.24 83.24,76.8 83.24,76.97 80,80.21 80,81.07 80.6,81.67 83.36,81.67 90.27,74.75 90.27,72.89 93.61,72.89 LED43.4-DIN
N$81
  Bottom 0.406: LED44.4-DIN 113.93,76.79 113.93,79.21 112.67,80.47 100,80.47 99.3,81.17 98.44,81.17 97.84,80.57 97.84,76.79 97.42,76.36 97.42,71.62 98.69,70.36 99.94,70.36 100.14,70.56 100.14,70.98 LED43.2-DOUT
R1
  Top 0.406: U$29.SW1@0 6.47,9.63 7.15,10.31 9.81,10.31 10.49,9.63 U$29.SW1@1 13.39,9.63 16.44,6.58 19.42,6.58 22.47,9.63 U$30.SW1@0 25.72,9.63 26.4,10.31 29.06,10.31 29.74,9.63 U$30.SW1@1 U$31.SW1@0 44.97,9.63 45.65,10.31 48.31,10.31 48.99,9.63 U$31.SW1@1 U$32.SW1@0 66.43,9.63 67.11,10.31 69.77,10.31 70.45,9.63 U$32.SW1@1 U$33.SW1@0 92.4,9.63 93.08,10.31 95.74,10.31 96.42,9.63 U$33.SW1@1 105.81,9.63 108.86,6.58 111.84,6.58 114.89,9.63 U$34.SW1@0 120.61,9.63 121.29,10.31 123.95,10.31 124.63,9.63 U$34.SW1@1
  Bottom 0.406: U$30.SW1@0 23.02,10.29 23.02,13.91 22.29,14.64 | JP3.10 23.1,52.68 20.96,50.54 20.96,25.49 22.27,24.18 22.27,16.27 22.29,16.26 22.29,14.64 | 22.29,14.64 22.27,14.65
R2  (via drill 0.6)
  Top 0.406: U$20.SW1@0 6.47,28.68 7.15,29.36 9.81,29.36 10.49,28.68 U$20.SW1@1 U$21.SW1@0 25.52,28.68 26.2,29.36 28.86,29.36 29.54,28.68 U$21.SW1@1 U$22.SW1@0 44.57,28.68 45.25,29.36 47.91,29.36 48.59,28.68 U$22.SW1@1 U$23.SW1@0 63.62,28.68 64.3,29.36 66.96,29.36 67.64,28.68 U$23.SW1@1 U$24.SW1@0 82.67,28.68 83.35,29.36 86.01,29.36 86.69,28.68 U$24.SW1@1 U$25.SW1@0 101.72,28.68 102.4,29.36 105.06,29.36 105.74,28.68 U$25.SW1@1 U$28.SW1@0 122.97,28.68 123.65,29.36 126.31,29.36 126.99,28.68 U$28.SW1@1 | v16.98,39.05 15.74,39.05 v8.9,32.2
  Bottom 0.406: 20.4,43.2 20.4,52.52 23.1,55.22 JP3.9 | 20.4,43.2 20.4,42.47 | U$20.SW1@1 11.38,29.54 10.35,29.54 8.9,30.99 v8.9,32.2 | 20.4,43.2 20.4,42.47 | 20.4,42.47 v16.98,39.05
R3
  Top 0.406: U$13.SW1@0 11.22,47.73 11.9,48.41 14.56,48.41 15.24,47.73 U$13.SW1@1 17.04,49.14 17.4,49.5 17.4,50.69 24.32,57.51 | 24.32,57.51 JP3.8 | U$18.SW1@1 123.3,48.27 118.65,48.27 118.01,47.63 U$18.SW1@0 U$17.SW1@1 96.56,47.73 95.88,48.41 93.22,48.41 92.54,47.73 U$17.SW1@0 U$16.SW1@1 77.36,47.73 76.68,48.41 74.02,48.41 73.34,47.73 U$16.SW1@0 U$15.SW1@1 58.16,47.73 57.48,48.41 54.82,48.41 54.14,47.73 U$15.SW1@0 U$14.SW1@1 40.8,47.67 38.7,47.67 38.2,48.17 35.95,48.17 35.41,47.63 U$14.SW1@0 33.22,49.11 29.18,53.15 29.18,53.86 28.88,54.15 27.99,54.15 | 27.99,54.15 27.57,54.15 | 27.57,54.15 27.37,54.36 27.37,54.46 24.32,57.51 | 27.99,54.15 27.57,54.15
R4
  Top 0.406: U$6.SW1@0 13.44,66.63 14.27,67.46 16.93,67.46 17.61,66.78 19.27,66.78 U$6.SW1@1 23.42,66.63 JP3.5 35.88,65.38 36.03,65.53 36.8,65.53 U$7.SW1@0 39.81,66.63 40.4,67.22 44.92,67.22 U$7.SW1@1 U$8.SW1@0 58.51,66.63 59.3,67.42 63.72,67.42 U$8.SW1@1 U$9.SW1@0 77.46,66.63 78.5,67.67 81.45,67.67 81.57,67.54 82.6,67.54 U$9.SW1@1 U$10.SW1@0 96.76,66.63 97.75,67.62 100.5,67.62 100.57,67.54 101.6,67.54 U$10.SW1@1 U$11.SW1@0 120.31,66.63 121.15,67.47 125.47,67.47 U$11.SW1@1
R5
  Top 0.406: U$3.SW1@0 50.14,85.63 50.18,85.67 52.32,85.67 52.37,85.63 U$3.SW1@1 56.19,85.63 59.44,88.88 62.42,88.88 65.67,85.63 U$4.SW1@0 69.14,85.63 69.19,85.67 71.33,85.67 71.37,85.63 U$4.SW1@1 U$5.SW1@0 88.14,85.63 88.19,85.67 90.33,85.67 90.37,85.63 U$5.SW1@1 U$26.SW1@0 107.14,85.63 107.19,85.67 109.33,85.67 109.37,85.63 U$26.SW1@1 112.86,85.63 116.11,88.88 119.09,88.88 122.34,85.63 U$12.SW1@0 126.14,85.63 126.19,85.67 128.33,85.67 128.37,85.63 U$12.SW1@1 | 23.45,85.63 U$2.SW1@0 31.14,85.63 31.19,85.67 33.32,85.67 33.37,85.63 U$2.SW1@1 36.91,85.63 39,87.72 45.35,87.72 U$3.SW1@0 | 23.45,85.63 U$1.SW1@1 11.97,85.63 11.93,85.67 9.79,85.67 9.74,85.63 U$1.SW1@0 | 47.33,85.63 U$3.SW1@0 | 23.45,85.63 22.45,84.63 22.45,79.37 22.4,79.32 22.4,76.77 22.76,76.41 23.61,76.41 24.47,75.54 JP3.1
SCL  (via drill 0.6)
  Top 0.406: v109.3,58.82 108.48,59.64 v26.29,59.64 | J12.4 J2.4 | v122.85,77.46 123.75,77.46 v125.5,75.71 126.1,75.11 J3.D+ | v112.65,78.43 112.97,78.1 117.6,78.1 118.78,76.92 v118.85,76.92
  Bottom 0.406: JP3.11 24.57,50.92 25.82,52.16 25.82,59.17 v26.29,59.64 | v112.65,78.43 110.72,76.19 110.72,65.08 110.83,64.97 110.83,61.45 109.3,59.92 v109.3,58.82 110.38,57.74 110.38,45.29 117.45,38.22 122.19,38.22 123.71,36.7 J12.4 | v118.85,76.92 119.21,76.56 121.97,76.56 122.85,77.44 v122.85,77.46 | J3.D+ 126.1,75.11 v125.5,75.71
SDA  (via drill 0.6)
  Top 0.406: v105.83,58.44 v27.99,58.44 | J12.5 J2.5 | v122.65,75.02 122.96,74.31 J5.D- 129.8,74.31 130.03,74.09 131.28,74.09 132.11,74.92 v132.3,74.92 | v112.15,79.53 118.36,79.53 v119.8,78.09
  Bottom 0.254: v27.99,58.44 26.84,57.29 26.59,57.29 26.43,57.13 26.43,55.9 | 26.43,55.9 26.43,55.4 | JP3.14 26.43,44.38 26.43,55.9
  Bottom 0.406: 107.8,58.44 107.8,59.32 110.27,61.79 110.27,64.73 110.16,64.85 110.16,77.54 v112.15,79.53 | 107.8,58.44 108.87,57.37 109.33,57.37 109.82,56.87 109.82,45.06 117.22,37.66 121.96,37.66 125.46,34.16 J12.5 | 107.8,58.44 v105.83,58.44 | v122.65,75.02 122.65,75.8 123.68,76.83 123.68,78.08 123.47,78.29 120.65,78.29 v119.8,78.09 | J3.D- 131.31,75.91 v132.3,74.92
VBAT  (via drill 0.6)
  Top 0.406: v99.31,71.19 103.69,71.19 v104.36,71.86 | C10.1 53.51,74.8 54.2,75.49 LED19.1-VDD 61.19,75.49 62.14,76.45 v65.7,76.45 73.25,76.45 | 73.25,76.45 76.33,76.45 LED20.1-VDD v79.55,75.49 80.24,75.49 81.15,76.4 | 81.15,76.4 81.19,76.45 | C5.1 73.54,76.16 73.25,76.45 | v98.25,75.74 98,75.49 LED21.1-VDD 92.3,75.49 91.62,74.81 C3.1 89.43,76.45 81.27,76.45 81.23,76.4 81.15,76.4 | LED17.1-VDD 31.13,56.41 31.86,57.14 31.86,57.16 32.07,57.37 38.96,57.37 | 38.96,57.37 47.9,57.37 LED16.1-VDD 51.81,56.41 52.76,57.37 55.17,57.37 55.38,57.16 55.38,56.35 C9.1 56.79,55.19 58.01,56.41 LED15.1-VDD 71.01,56.41 71.96,57.37 74.37,57.37 74.58,57.16 74.58,57.14 C7.1 76.56,55.91 77.06,56.41 LED14.1-VDD 90.11,56.41 91.06,57.37 96.11,57.37 | C2.1 39.5,56.83 38.96,57.37 | 107.35,56.41 LED13.1-VDD 108.54,56.42 110.4,56.42 113.75,59.77 C4.1 114.82,61.28 115.72,61.28 120.29,56.72 v120.7,56.72 | 107.35,56.41 99.97,56.41 99.93,56.44 98.24,57.37 96.11,57.37 | C1.1 96.9,56.58 96.11,57.37 | 58.01,38.32 48.08,38.32 47.34,37.57 46.58,37.57 46.37,37.36 LED9.1-VDD 38.96,37.36 37.76,36.16 C12.1 36.47,37.35 34.63,37.35 33.68,36.4 25.97,36.4 v25.3,37.07 23.28,37.07 LED8.1-VDD | 58.01,38.32 62.46,38.32 LED10.1-VDD 65.42,37.36 65.63,37.57 66.58,37.57 67.32,38.32 77.06,38.32 | 77.06,38.32 81.59,38.32 LED11.1-VDD 84.47,37.36 84.68,37.57 85.71,37.57 86.45,38.32 96.11,38.32 | 96.11,38.32 104.63,38.32 LED12.1-VDD 106,37.36 106.76,38.12 | 106.76,38.12 C13.1 | 106.76,38.12 106.76,37.62 v107.58,36.8 | C16.1 96.32,38.11 96.11,38.32 | C14.1 75.89,37.15 77.06,38.32 | C15.1 57.22,37.53 58.01,38.32
  Top 0.406: v19.11,18.33 LED7.1-VDD | 27.53,19.37 33.82,19.37 LED6.1-VDD 36.21,18.33 37.45,19.57 46.58,19.57 | 46.58,19.57 52.52,19.57 LED5.1-VDD 56.61,18.33 57.55,19.27 57.65,19.27 57.66,19.29 65.63,19.29 | C23.1 28.01,18.89 27.53,19.37 | C27.1 47.29,18.86 46.58,19.57 | v113.65,16.47 113.65,16.59 LED2.1-VDD 110.87,19.37 103.73,19.37 | 65.63,19.29 71.88,19.29 LED4.1-VDD 75.21,18.33 76.35,19.47 84.68,19.47 | 84.68,19.47 90.7,19.47 LED3.1-VDD 94.51,18.33 95.55,19.37 103.73,19.37 | C25.1 105.14,17.96 103.73,19.37 | C28.1 85.41,18.74 84.68,19.47 | C24.1 66.44,18.48 65.63,19.29 | 19.63,73.72 v20.3,73.72 | v106.85,55.12 106.85,55.91 107.35,56.41 | 17.62,18.32 v19.11,18.33 | v13.55,80.67 12.09,80.67 11.93,80.51 6.44,80.51 v5.6,79.67 | J2.2 J12.2 130.6,42.49 131.9,43.78 131.9,46.63 128.4,50.13 127.29,50.13 v120.7,56.72 | 126.8,76.31 127.01,76.1 | 127.01,76.1 128.22,76.1 J5.ID 128.6,75.72 129.81,75.72 130.6,74.92 v130.65,74.92 | J4.2 121.49,57.51 v120.7,56.72 | v120.92,73.83 121.82,74.73 121.82,77.88 122.22,78.29 124.38,78.29 126.56,76.1 127.01,76.1 | v20.3,73.72 23.53,73.72 24.05,74.24 25.09,74.24 26.68,72.65 36.18,72.65 38.81,75.27 LED18.1-VDD 40,74.18 v41.18,74.18 | v20.3,73.72 18.59,73.72 LED1.1-VDD 16.27,74.86 C11.1 | 113.6,74.3 C8.1 | 113.6,74.3 LED22.1-VDD | 113.6,74.3 113.03,73.73 C6.1 | v19.11,18.33 19.49,18.71 19.49,19.08 19.79,19.37 27.53,19.37
  Bottom 0.406: 111.35,22.33 111.39,22.37 | 111.39,22.37 111.39,27.87 112.58,29.07 C26.1 107.58,34.92 v107.58,36.8 109.73,36.8 LED34.1-VDD | v104.36,71.86 105.49,71.86 C8.1 | v99.31,71.19 98.25,72.25 v98.25,75.74 98.5,75.49 LED43.1-VDD | 111.84,69.7 111.84,65.54 112.56,64.82 112.56,64.4 113.75,63.2 C4.1 | 111.84,69.7 111.84,69.77 | 114.78,17.64 114.78,18.89 111.39,22.29 111.39,22.37 | v113.65,16.47 113.65,16.51 114.78,17.64 | C10.1 52.32,73.13 50.48,73.13 49.42,74.18 v41.18,74.18 42.18,75.18 42.66,75.18 42.85,75.37 LED40.1-VDD | LED42.1-VDD v79.55,75.49 | LED41.1-VDD 64.74,75.49 v65.7,76.45 | LED36.1-VDD 95.74,56.41 C1.1 | LED37.1-VDD 75.31,56.41 C7.1 | LED38.1-VDD 55.32,56.41 C9.1 | LED39.1-VDD 38.42,56.41 C2.1 | 36.46,37.36 C12.1 | LED31.1-VDD 53.66,37.36 54.19,37.88 56.03,37.88 C15.1 | LED32.1-VDD 72.46,37.36 72.86,37.75 74.7,37.75 C14.1 | LED33.1-VDD 92.8,37.36 93.29,37.84 95.13,37.84 C16.1 | LED24.1-VDD 115.47,18.33 114.78,17.64 | LED25.1-VDD 101.51,18.33 102.11,18.92 103.95,18.92 C25.1 | LED26.1-VDD 81.75,18.33 82.38,18.95 84.22,18.95 C28.1 | LED27.1-VDD 63.08,18.33 63.41,18.65 65.25,18.65 C24.1 | LED28.1-VDD 43.53,18.33 44.26,19.05 46.1,19.05 C27.1 | C13.1 106.76,42.31 107.95,43.51 107.95,44.49 106.85,45.6 106.85,52.23 106.71,52.36 106.71,53.86 106.85,53.99 v106.85,55.12 | 119.43,75.49 LED44.1-VDD 120.92,74.94 v120.92,73.83 | 119.43,75.49 116.98,75.49 114.64,73.15 114.35,73.15 | LED30.1-VDD 25.59,37.36 v25.3,37.07 | 14.94,76.22 14.94,79.28 v13.55,80.67 | v5.6,79.67 5.2,79.67 J1.18 | 119.85,75.91 119.43,75.49 | C17.+ 28.03,79.51 26.12,81.42 23.13,81.42 20.27,78.56 19.41,78.56 19.02,78.95 17.26,78.95 16.56,78.25 16.56,77.84 14.94,76.22
  Bottom 0.406: J3.ID 130.04,74.31 v130.65,74.92 | J11.2 121.91,55.51 v120.7,56.72 113.98,56.72 LED35.1-VDD | 114.35,73.15 113.62,73.15 | 14.94,76.22 14.94,74.95 C11.1 | v19.11,18.33 LED29.1-VDD | v20.3,73.72 20.71,73.72 LED23.1-VDD | 111.84,69.7 C6.1 113.41,71.27 113.41,72.94 113.62,73.15 | 114.35,73.15 113.62,73.15
VUSB  (via drill 0.6)
  Top 0.406: v22.35,61.82 23.83,61.82 24.05,61.6 25.57,61.6 25.87,61.29 26.28,61.29 27.37,60.2 108.71,60.2 108.93,59.98 v111.39,59.98 | J12.3 J2.3 | v117.2,77.04 117.16,77 116.9,77.27 v113.05,77.27 | J5.VBUS 126.04,73.51 v125.65,73.12
  Bottom 0.406: v113.05,77.27 111.28,75.1 111.28,65.31 111.39,65.2 v111.39,59.98 111.39,45.07 116.32,40.14 125.31,40.14 126.21,39.24 J12.3 | J1.19 1.74,85.67 4.35,85.67 4.35,83.7 4.33,83.69 4.33,82.49 11.3,75.53 11.3,74.28 13.66,71.92 13.66,71.83 14.36,71.13 14.45,71.13 | 15.29,71.13 18.49,71.13 22.35,67.26 v22.35,61.82 | 15.29,71.13 14.45,71.13 | v117.2,77.04 117.22,77.04 119.55,79.37 121.97,79.37 122.49,78.85 123.71,78.85 | 123.71,78.85 124.24,78.32 124.24,76.6 123.5,75.86 124.32,75.05 124.32,74.48 125.65,73.15 v125.65,73.12 | J3.VBUS 128.36,76.71 126.2,78.87 123.72,78.87 123.71,78.85 | 15.29,71.13 14.45,71.13

## Text on the board
tPlace: Audio in
bPlace: Audio in
tNames: M3 | M3 | GND | VUSB | Esc | ~ | 1 | 2 | 3 | 4 | 5 | VBAT | 3.3V | RST | 16 | 13 | 17 | 4 | I2C | 12 | 4 | 14 | 0 | Tab | Q | W | E | R | T | 27 | 2 | 26 | 15 | 25 | 5 | 35 | 18 | 34 | 23 | 33 | VBAT | 19 | 32 | 22 | + | 39 | Caps | A | S | D | F | G | RX | I2C | 38 | TX | 37 | 21 | 36 | GND | TACOCAT v1.01 | Shift | Z | X | C | V | B | Extra | Audio out | Left | Ctrl | Win | Alt | Extra | Back | Space | M3 | M3
bNames: M3 | M3 | GND | Extra | + | 0 | 9 | 8 | 7 | 6 | I2C | [ ] | P | O | I | U | Y | VBAT | " | ; | L | K | J | H | I2C | / | Up | < | > | M | N | Extra | Audio out | Right | Left | Down | Right | Extra | Del | Enter | M3 | M3
tValues: +
Notes: NOTE: all switches, LEDs, diodes, resistor and capacitors go on one side / of the board; all remaining IO (USB, pogopins and TRRS) go on the opposite side | NOTE: the position of the TRRS ports will hit the alignment pins of the switches. / There is no way around this since there isn't enough space between the switches; / the workaround will be to trim off the excess pin stickout out of the PCB. | NOTE: the alignment pins for the springed male I2C connector / will have to be drilled manually